# Altium schematic sheet 0217_GPU PCIE X16.SchDoc
size 848 x 558 mm
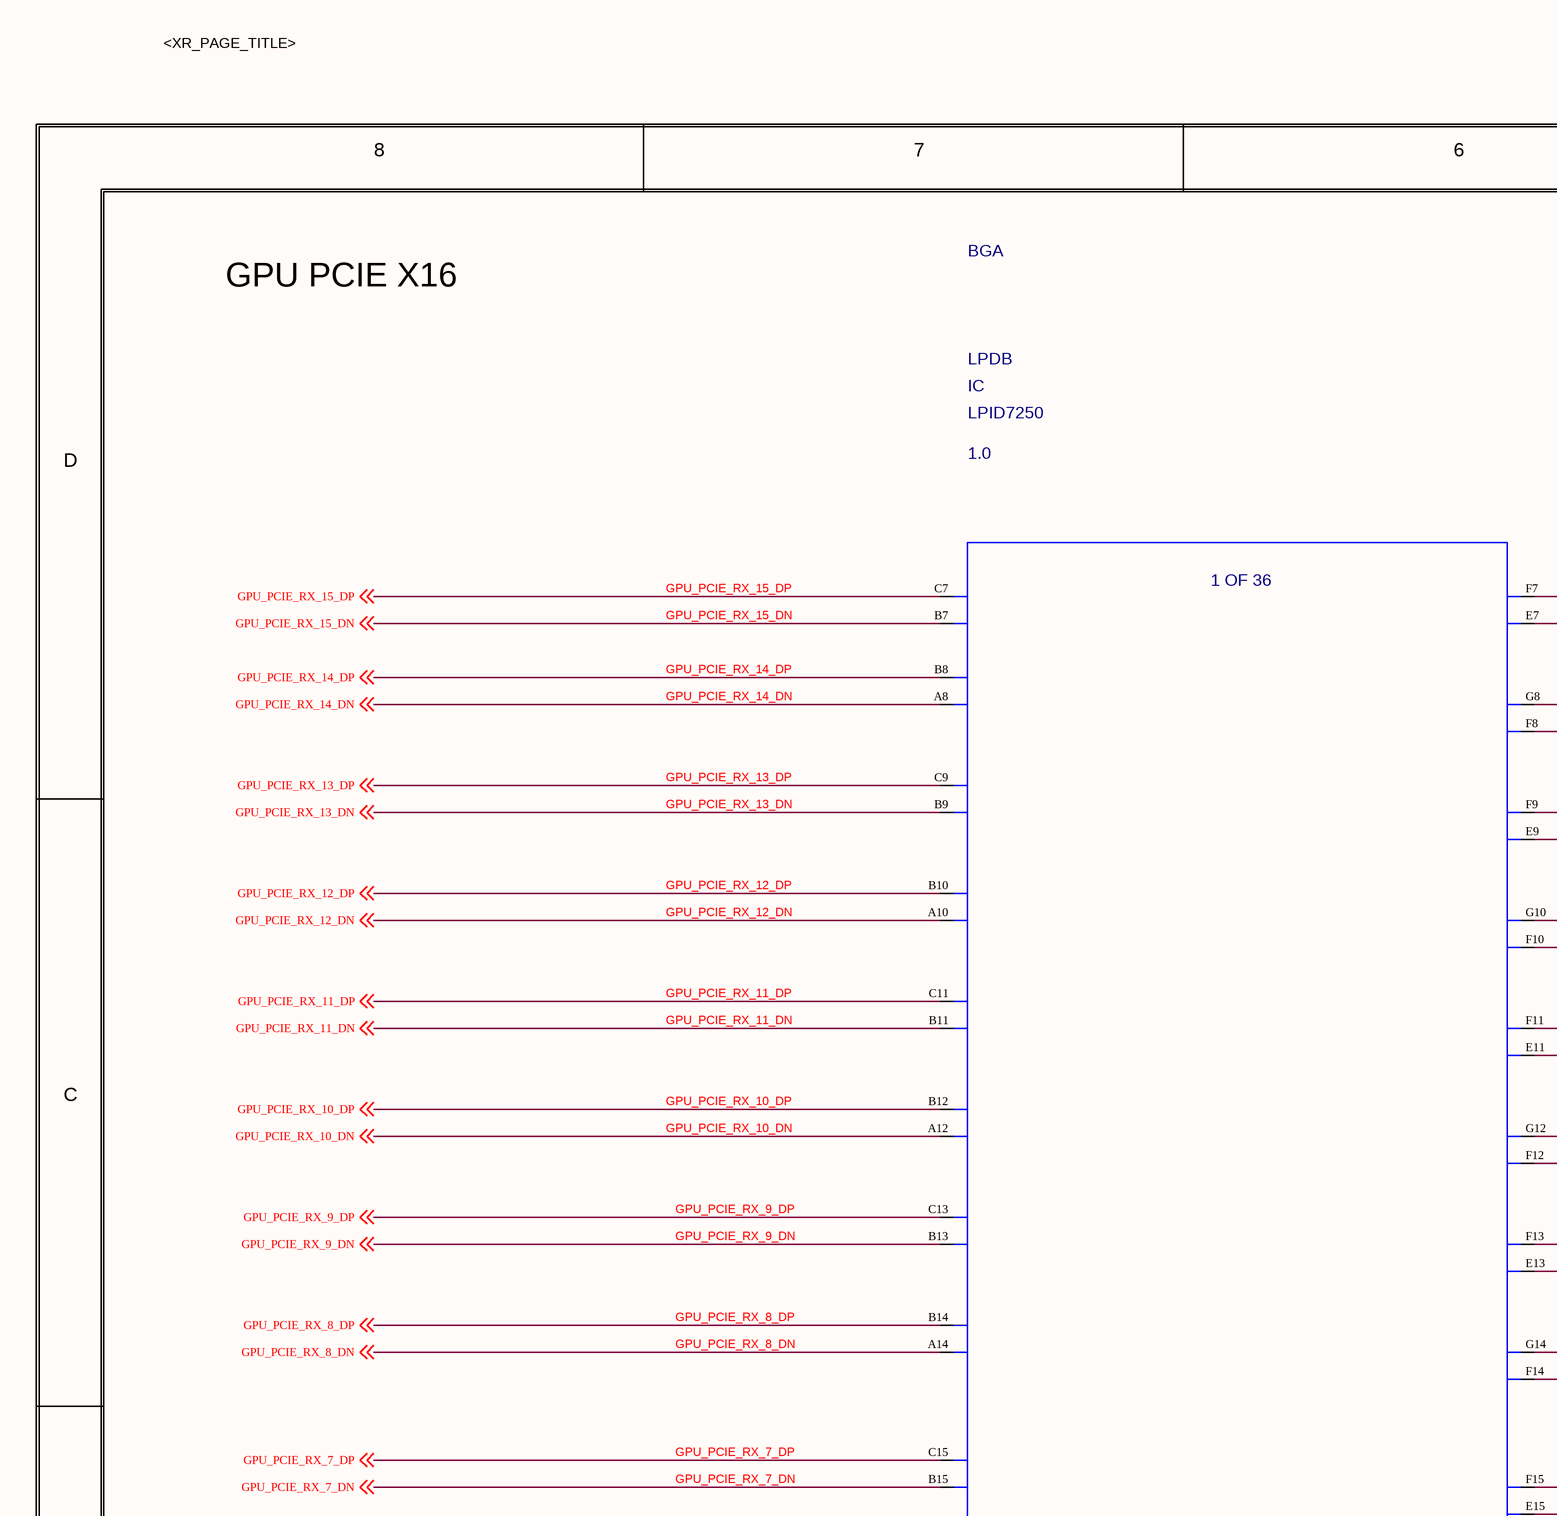
[diagram p0: 0217_GPU PCIE X16.SchDoc, top left]
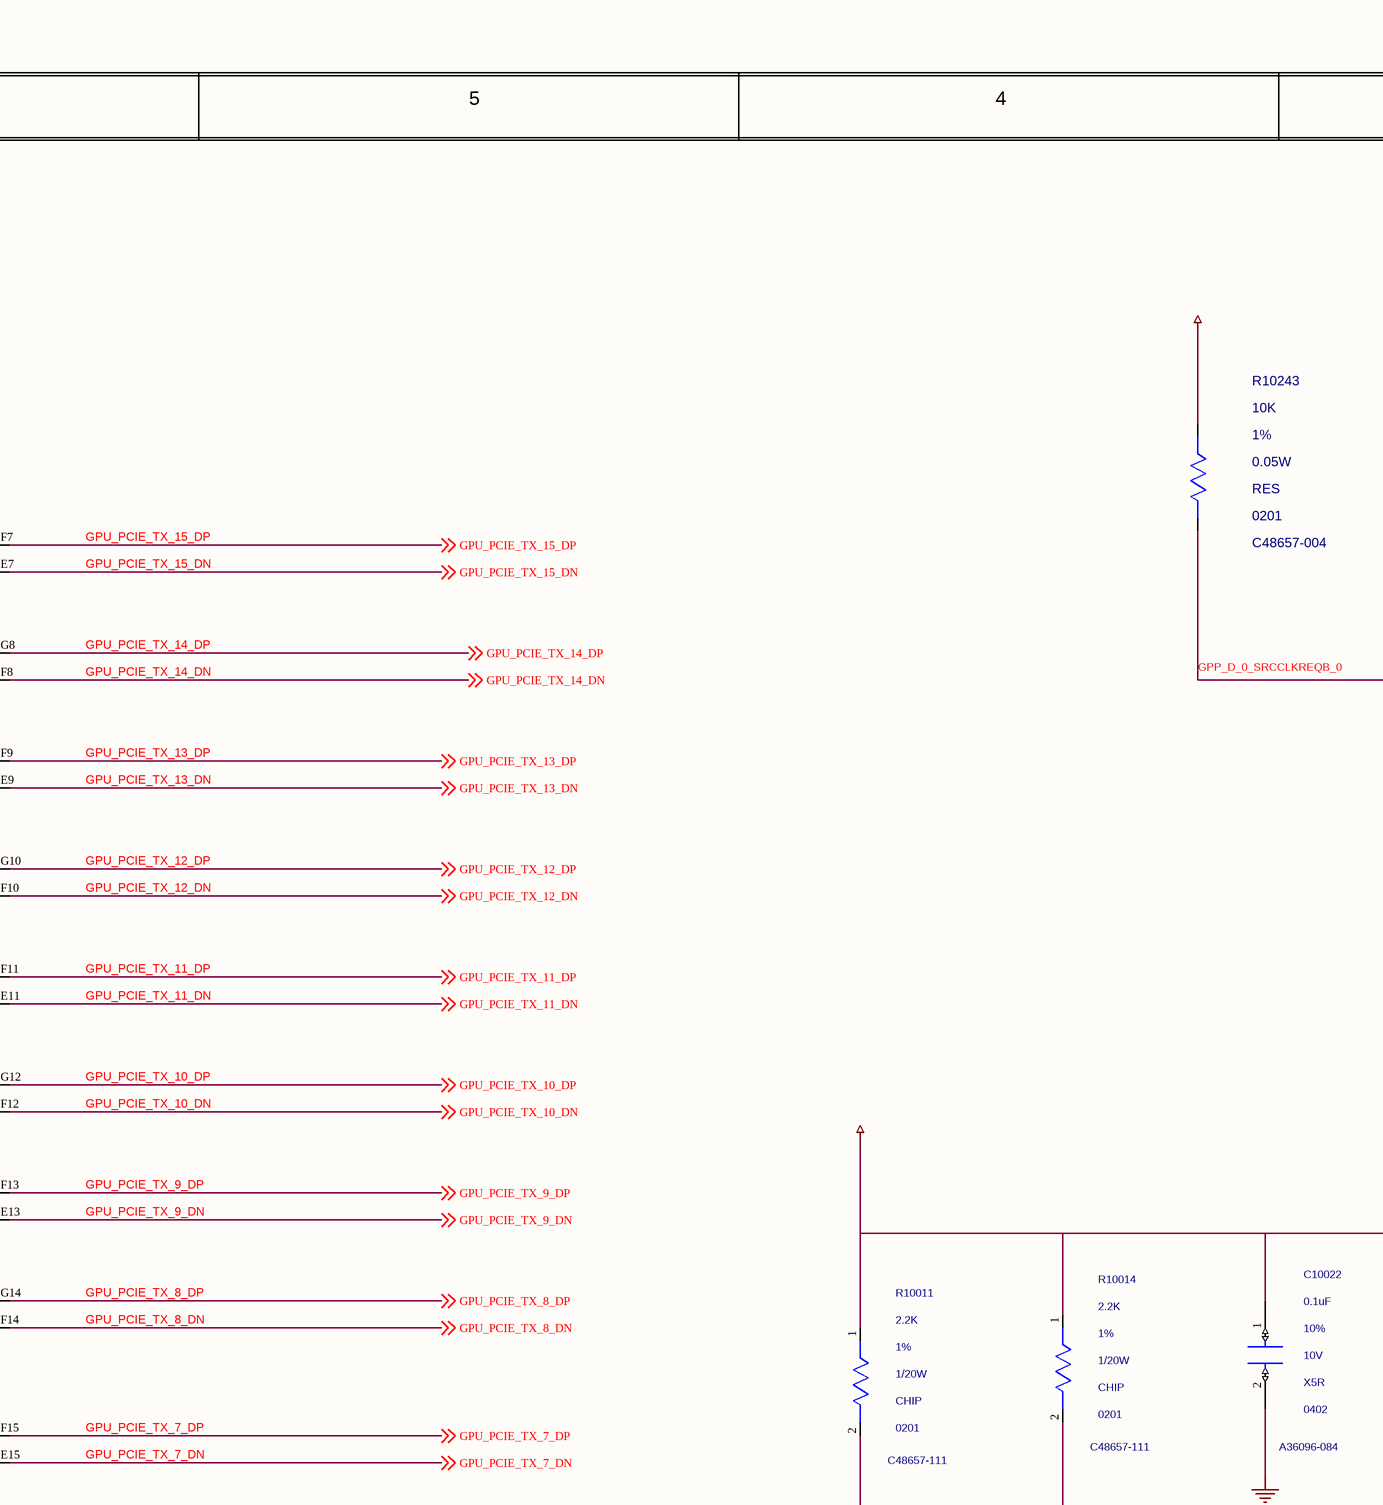
[diagram p1: 0217_GPU PCIE X16.SchDoc, top middle]
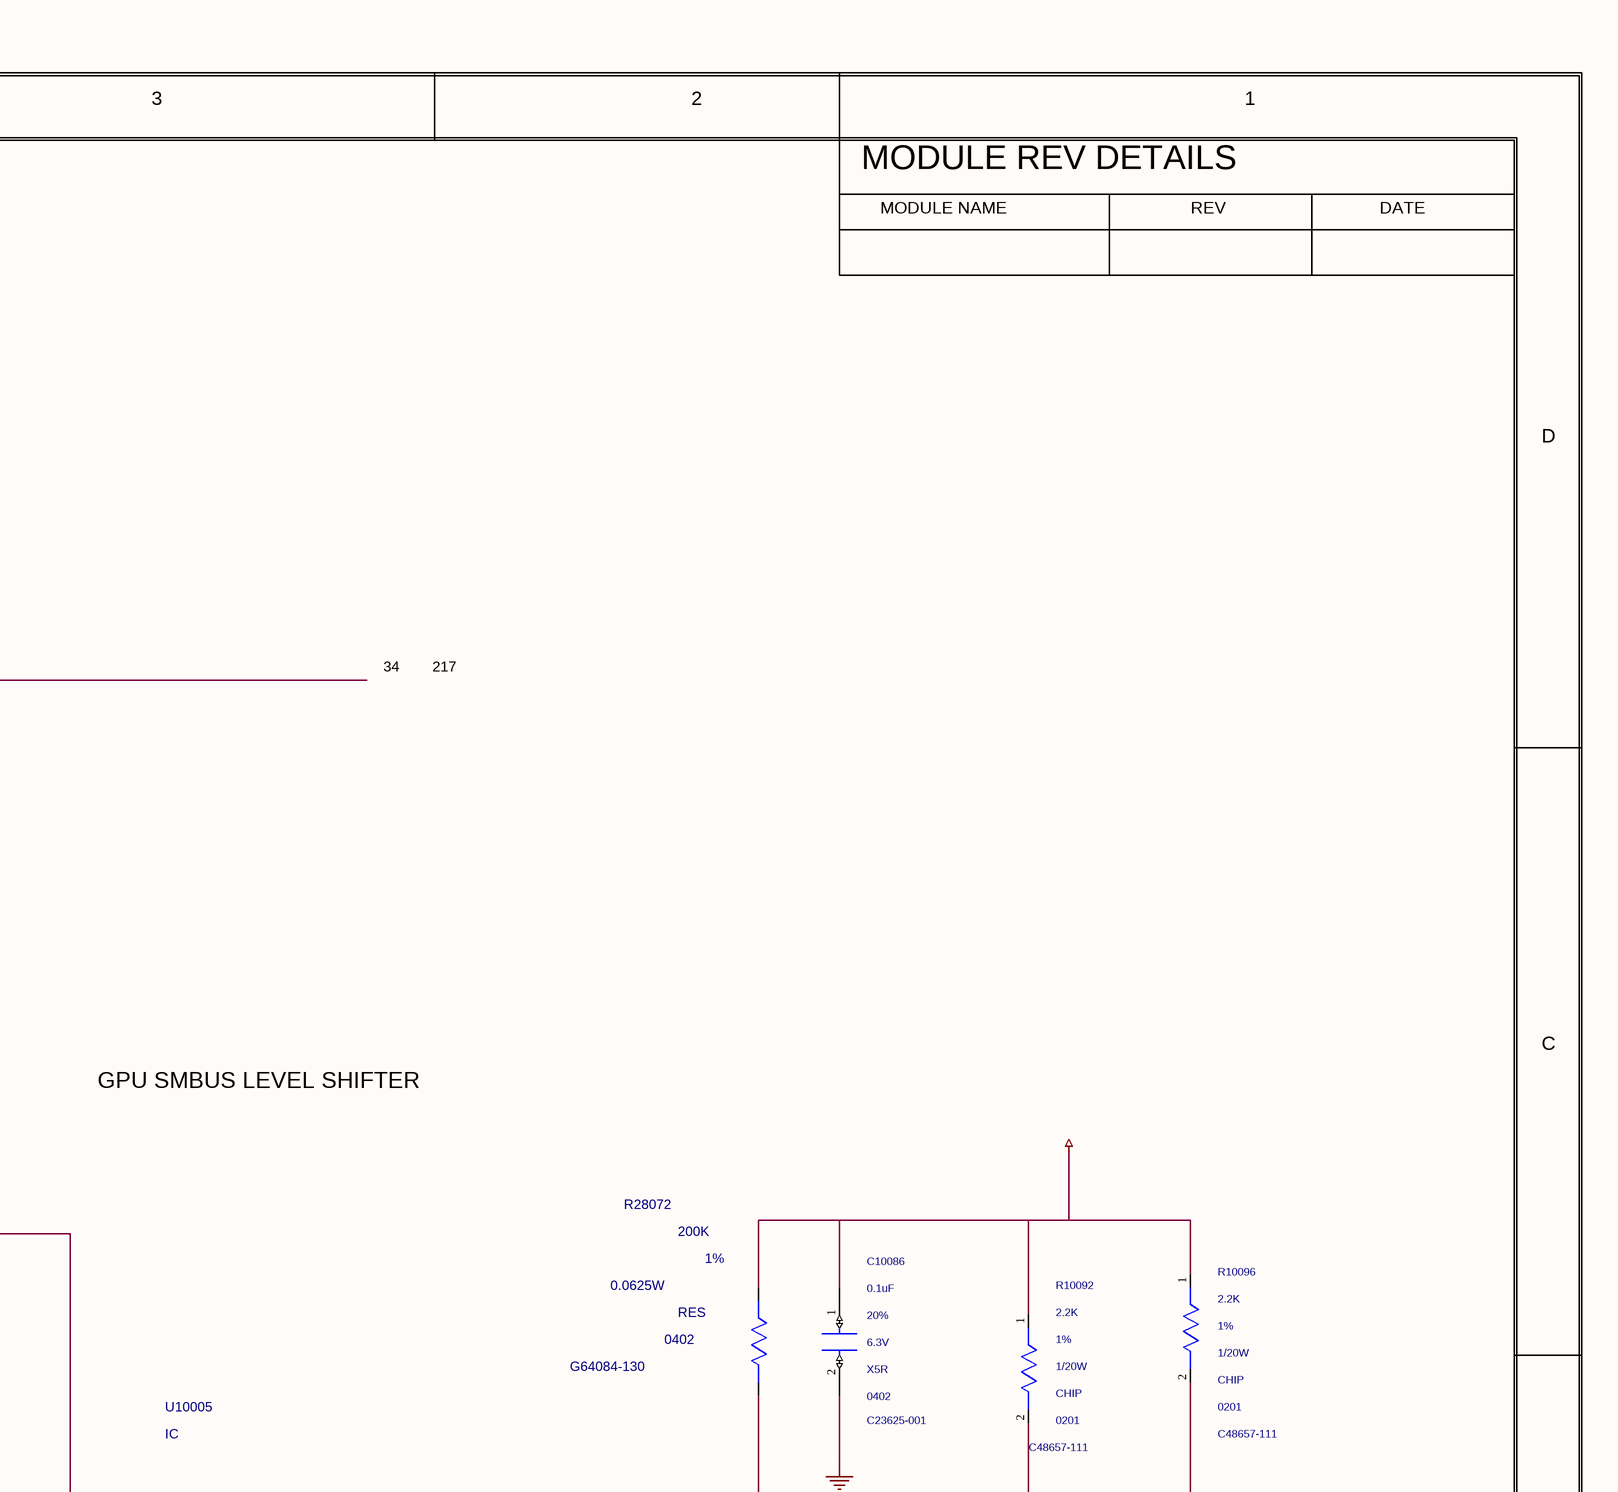
[diagram p2: 0217_GPU PCIE X16.SchDoc, top right]
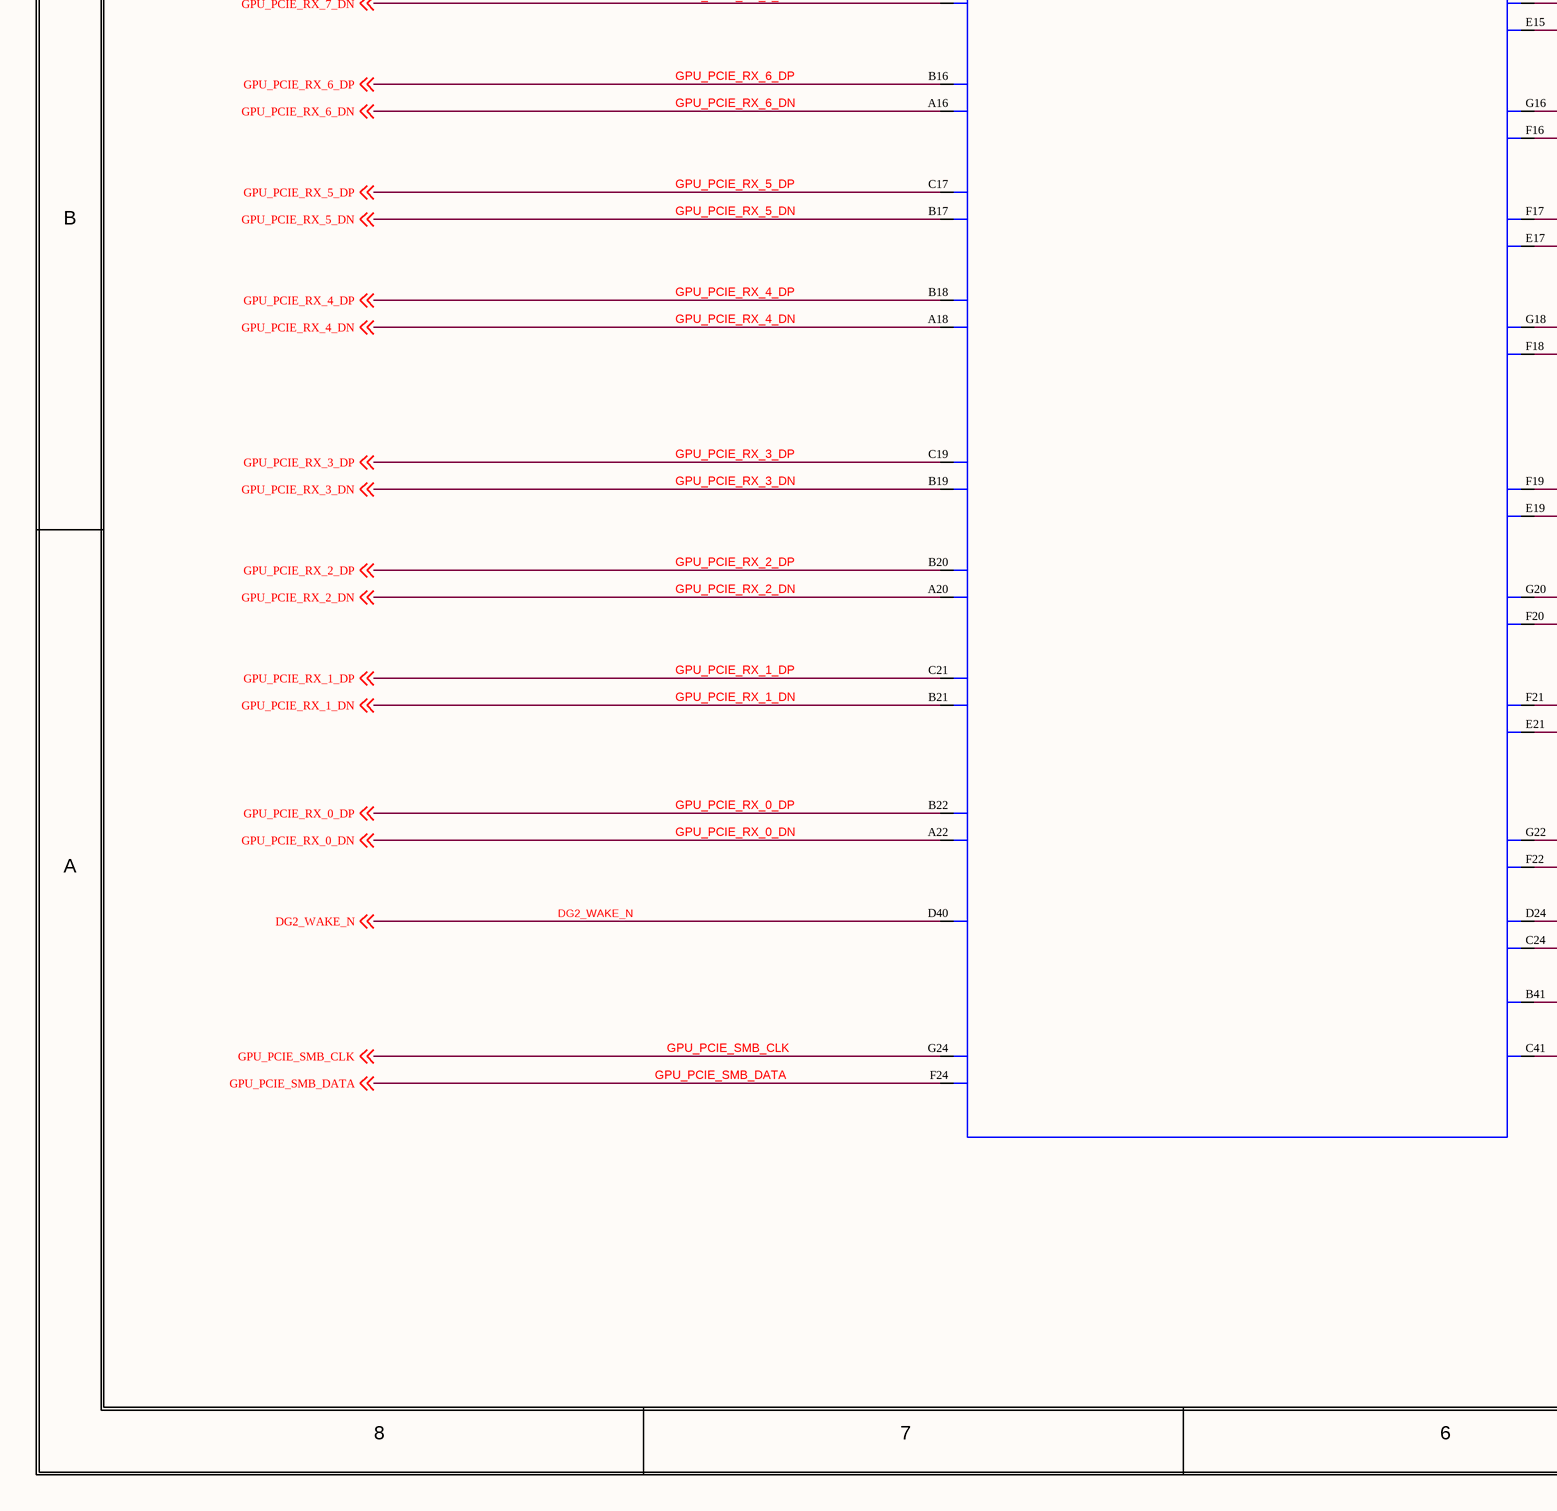
[diagram p3: 0217_GPU PCIE X16.SchDoc, bottom left]
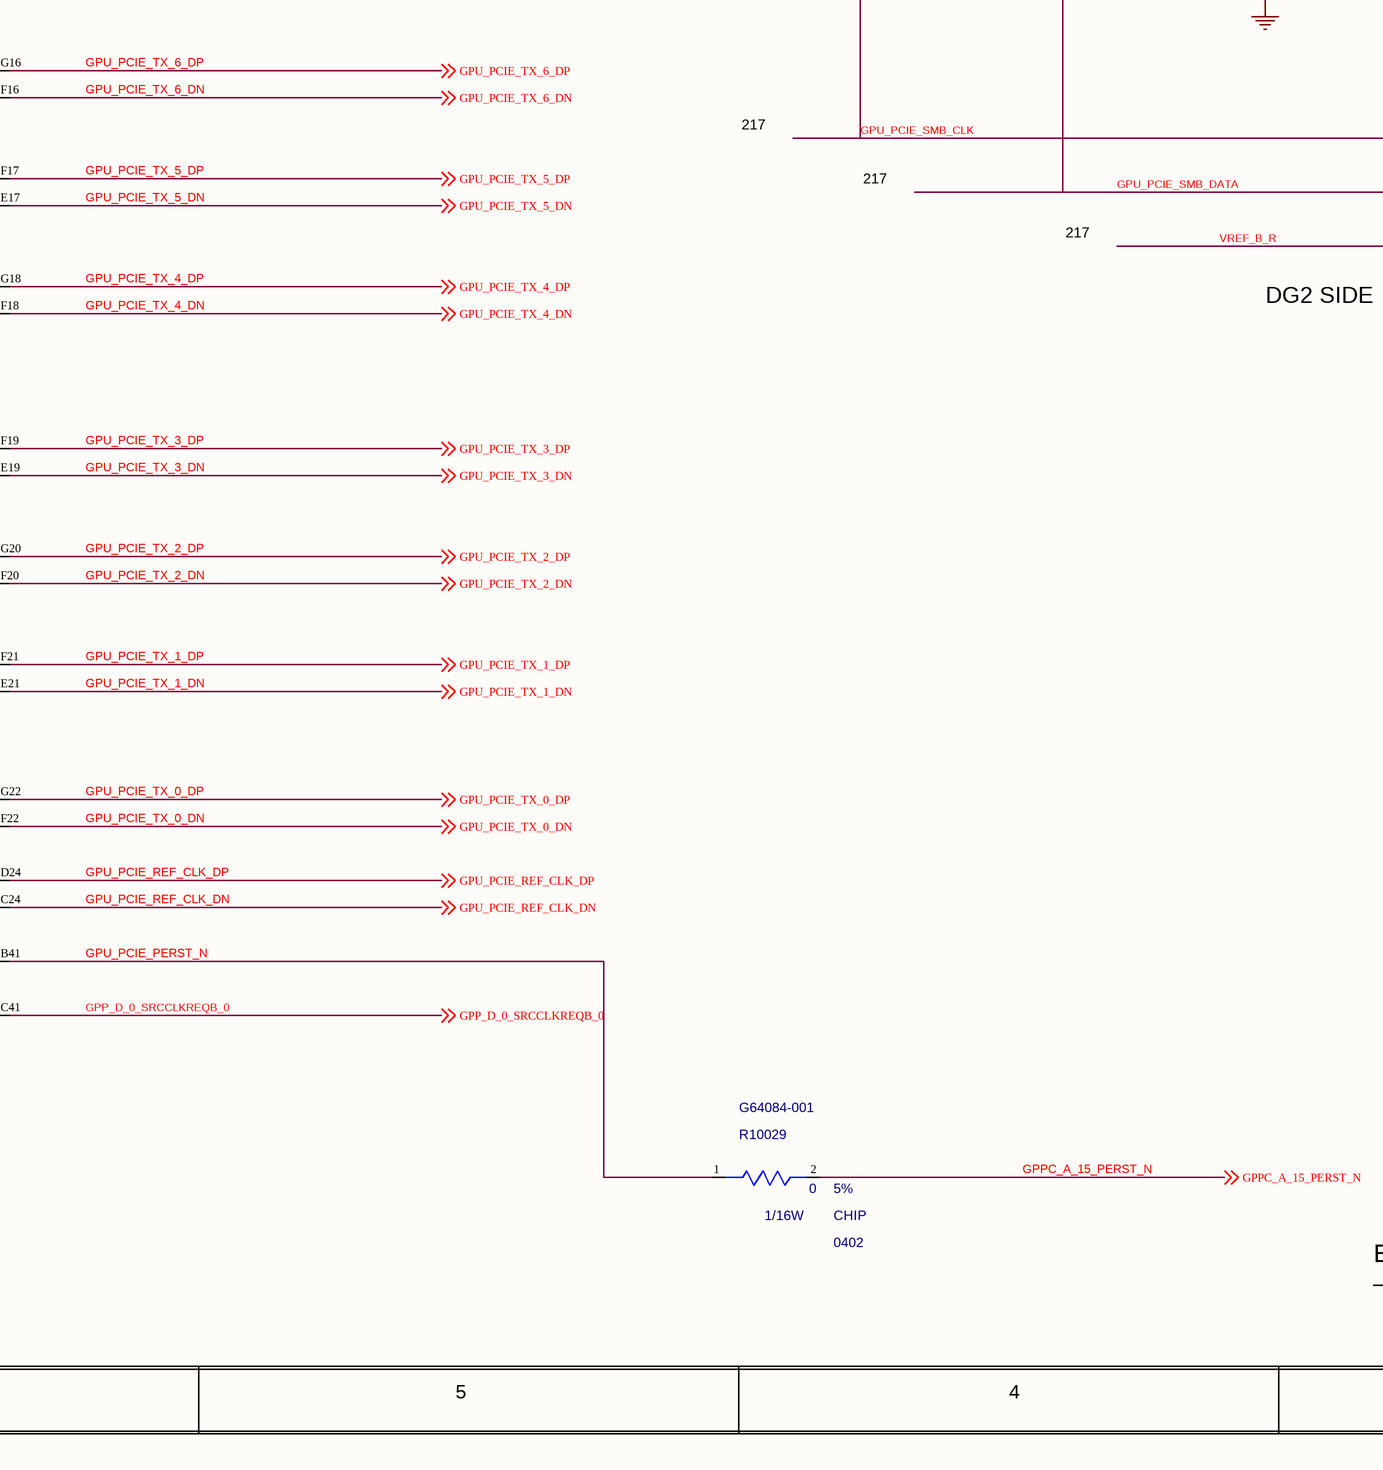
[diagram p4: 0217_GPU PCIE X16.SchDoc, bottom middle]
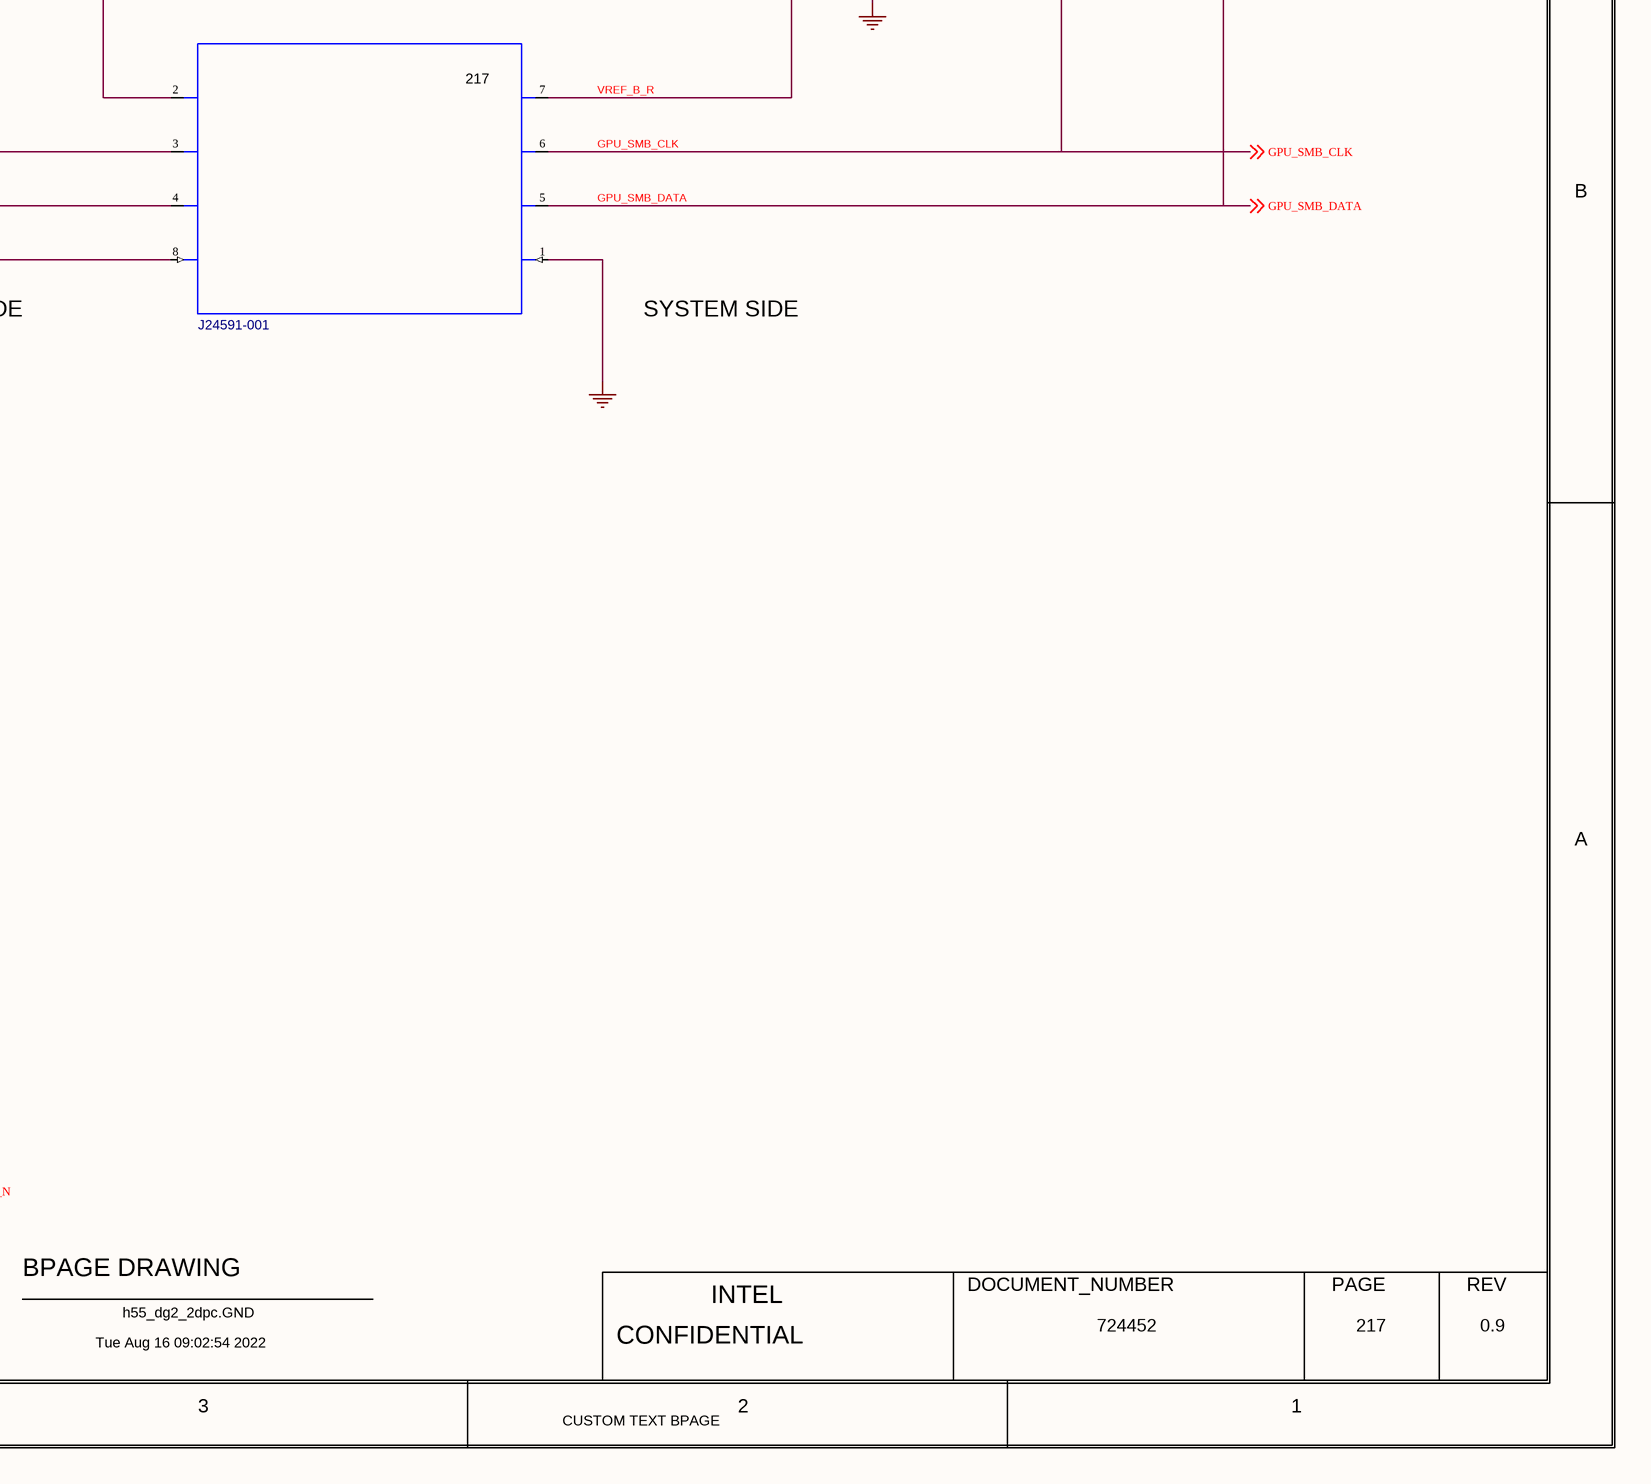
[diagram p5: 0217_GPU PCIE X16.SchDoc, bottom right]

## Parts
C10022  0.1uF  MATERIAL: X5R  PACK_TYPE: 0402  PART_NUMBER: A36096-084  TOLERANCE: 10%  VOLTAGE: 10V  [SMC0402IA]
C10086  0.1uF  MATERIAL: X5R  PACK_TYPE: 0402  PART_NUMBER: C23625-001  TOLERANCE: 20%  VOLTAGE: 6.3V  [SMC0402IA]
R10011  2.2K  MATERIAL: CHIP  PACK_TYPE: 0201  PART_NUMBER: C48657-111  TOLERANCE: 1%  WATTAGE: 1/20W  [SMR0201IA]
R10014  2.2K  MATERIAL: CHIP  PACK_TYPE: 0201  PART_NUMBER: C48657-111  TOLERANCE: 1%  WATTAGE: 1/20W  [SMR0201IA]
R10029  0  MATERIAL: CHIP  PACK_TYPE: 0402  PART_NUMBER: G64084-001  TOLERANCE: 5%  WATTAGE: 1/16W  [SMR0402IA]
R10092  2.2K  MATERIAL: CHIP  PACK_TYPE: 0201  PART_NUMBER: C48657-111  TOLERANCE: 1%  WATTAGE: 1/20W  [SMR0201IA]
R10096  2.2K  MATERIAL: CHIP  PACK_TYPE: 0201  PART_NUMBER: C48657-111  TOLERANCE: 1%  WATTAGE: 1/20W  [SMR0201IA]
R10243  10K  MATERIAL: RES  PACK_TYPE: 0201  PART_NUMBER: C48657-004  TOLERANCE: 1%  WATTAGE: 0.05W  [CTK0_SM0201_630X330_MA]
R28072  200K  MATERIAL: RES  PACK_TYPE: 0402  PART_NUMBER: G64084-130  TOLERANCE: 1%  WATTAGE: 0.0625W  [CTK0_SM0402_1100X550_MA]
U10000  PART_NUMBER: LPID7250  PACK_TYPE: BGA  MATERIAL: IC  FP_TECH: LPDB  BMAP_REV: 1.0  [CLPDB_BGA2660_DG2_SVC_512_LP7250_MA]  (hidden comment: DG2_IP_NB_SKU1_SKU2_SKU3_EXT)  (part A of 36)
U10005  MATERIAL: IC  PART_NUMBER: J24591-001  [CTK0_VSSOP8_2400X2100_500_MA]  (hidden comment: C_LSF0102)

## Nets
+V1P8S_GPU: C10022.1(A) R10011.1(A) R10014.1(A) R10243.1(A) U10005.2(VREF_A)
+V3P3S_GPU: C10086.1(A) R10092.1(A) R10096.1(A) R28072.1(A)
GND: C10022.2(B) C10086.2(B) U10005.1(GND)
DG2_WAKE_N: U10000.D40(WAKE#) ; off-sheet DG2_WAKE_N
GPP_D_0_SRCCLKREQB_0: R10243.2(B) U10000.C41(CLKREQ#) ; off-sheet GPP_D_0_SRCCLKREQB_0
GPPC_A_15_PERST_N: R10029.2(B) ; off-sheet GPPC_A_15_PERST_N
GPU_PCIE_PERST_N: R10029.1(A) U10000.B41(PERST#)
GPU_PCIE_REF_CLK_DN: U10000.C24(PCIE_REF_CLK_N) ; off-sheet GPU_PCIE_REF_CLK_DN
GPU_PCIE_REF_CLK_DP: U10000.D24(PCIE_REF_CLK_P) ; off-sheet GPU_PCIE_REF_CLK_DP
GPU_PCIE_RX_0_DN: U10000.A22(PCIE_RX_N_0) ; off-sheet GPU_PCIE_RX_0_DN
GPU_PCIE_RX_0_DP: U10000.B22(PCIE_RX_P_0) ; off-sheet GPU_PCIE_RX_0_DP
GPU_PCIE_RX_1_DN: U10000.B21(PCIE_RX_N_1) ; off-sheet GPU_PCIE_RX_1_DN
GPU_PCIE_RX_1_DP: U10000.C21(PCIE_RX_P_1) ; off-sheet GPU_PCIE_RX_1_DP
GPU_PCIE_RX_2_DN: U10000.A20(PCIE_RX_N_2) ; off-sheet GPU_PCIE_RX_2_DN
GPU_PCIE_RX_2_DP: U10000.B20(PCIE_RX_P_2) ; off-sheet GPU_PCIE_RX_2_DP
GPU_PCIE_RX_3_DN: U10000.B19(PCIE_RX_N_3) ; off-sheet GPU_PCIE_RX_3_DN
GPU_PCIE_RX_3_DP: U10000.C19(PCIE_RX_P_3) ; off-sheet GPU_PCIE_RX_3_DP
GPU_PCIE_RX_4_DN: U10000.A18(PCIE_RX_N_4) ; off-sheet GPU_PCIE_RX_4_DN
GPU_PCIE_RX_4_DP: U10000.B18(PCIE_RX_P_4) ; off-sheet GPU_PCIE_RX_4_DP
GPU_PCIE_RX_5_DN: U10000.B17(PCIE_RX_N_5) ; off-sheet GPU_PCIE_RX_5_DN
GPU_PCIE_RX_5_DP: U10000.C17(PCIE_RX_P_5) ; off-sheet GPU_PCIE_RX_5_DP
GPU_PCIE_RX_6_DN: U10000.A16(PCIE_RX_N_6) ; off-sheet GPU_PCIE_RX_6_DN
GPU_PCIE_RX_6_DP: U10000.B16(PCIE_RX_P_6) ; off-sheet GPU_PCIE_RX_6_DP
GPU_PCIE_RX_7_DN: U10000.B15(PCIE_RX_N_7) ; off-sheet GPU_PCIE_RX_7_DN
GPU_PCIE_RX_7_DP: U10000.C15(PCIE_RX_P_7) ; off-sheet GPU_PCIE_RX_7_DP
GPU_PCIE_RX_8_DN: U10000.A14(PCIE_RX_N_8) ; off-sheet GPU_PCIE_RX_8_DN
GPU_PCIE_RX_8_DP: U10000.B14(PCIE_RX_P_8) ; off-sheet GPU_PCIE_RX_8_DP
GPU_PCIE_RX_9_DN: U10000.B13(PCIE_RX_N_9) ; off-sheet GPU_PCIE_RX_9_DN
GPU_PCIE_RX_9_DP: U10000.C13(PCIE_RX_P_9) ; off-sheet GPU_PCIE_RX_9_DP
GPU_PCIE_RX_10_DN: U10000.A12(PCIE_RX_N_10) ; off-sheet GPU_PCIE_RX_10_DN
GPU_PCIE_RX_10_DP: U10000.B12(PCIE_RX_P_10) ; off-sheet GPU_PCIE_RX_10_DP
GPU_PCIE_RX_11_DN: U10000.B11(PCIE_RX_N_11) ; off-sheet GPU_PCIE_RX_11_DN
GPU_PCIE_RX_11_DP: U10000.C11(PCIE_RX_P_11) ; off-sheet GPU_PCIE_RX_11_DP
GPU_PCIE_RX_12_DN: U10000.A10(PCIE_RX_N_12) ; off-sheet GPU_PCIE_RX_12_DN
GPU_PCIE_RX_12_DP: U10000.B10(PCIE_RX_P_12) ; off-sheet GPU_PCIE_RX_12_DP
GPU_PCIE_RX_13_DN: U10000.B9(PCIE_RX_N_13) ; off-sheet GPU_PCIE_RX_13_DN
GPU_PCIE_RX_13_DP: U10000.C9(PCIE_RX_P_13) ; off-sheet GPU_PCIE_RX_13_DP
GPU_PCIE_RX_14_DN: U10000.A8(PCIE_RX_N_14) ; off-sheet GPU_PCIE_RX_14_DN
GPU_PCIE_RX_14_DP: U10000.B8(PCIE_RX_P_14) ; off-sheet GPU_PCIE_RX_14_DP
GPU_PCIE_RX_15_DN: U10000.B7(PCIE_RX_N_15) ; off-sheet GPU_PCIE_RX_15_DN
GPU_PCIE_RX_15_DP: U10000.C7(PCIE_RX_P_15) ; off-sheet GPU_PCIE_RX_15_DP
GPU_PCIE_SMB_CLK: R10011.2(B) U10000.G24(PCIE_SMB_CLK) U10005.3(A1) ; off-sheet GPU_PCIE_SMB_CLK
GPU_PCIE_SMB_DATA: R10014.2(B) U10000.F24(PCIE_SMB_DATA) U10005.4(A2) ; off-sheet GPU_PCIE_SMB_DATA
GPU_PCIE_TX_0_DN: U10000.F22(PCIE_TX_N_0) ; off-sheet GPU_PCIE_TX_0_DN
GPU_PCIE_TX_0_DP: U10000.G22(PCIE_TX_P_0) ; off-sheet GPU_PCIE_TX_0_DP
GPU_PCIE_TX_1_DN: U10000.E21(PCIE_TX_N_1) ; off-sheet GPU_PCIE_TX_1_DN
GPU_PCIE_TX_1_DP: U10000.F21(PCIE_TX_P_1) ; off-sheet GPU_PCIE_TX_1_DP
GPU_PCIE_TX_2_DN: U10000.F20(PCIE_TX_N_2) ; off-sheet GPU_PCIE_TX_2_DN
GPU_PCIE_TX_2_DP: U10000.G20(PCIE_TX_P_2) ; off-sheet GPU_PCIE_TX_2_DP
GPU_PCIE_TX_3_DN: U10000.E19(PCIE_TX_N_3) ; off-sheet GPU_PCIE_TX_3_DN
GPU_PCIE_TX_3_DP: U10000.F19(PCIE_TX_P_3) ; off-sheet GPU_PCIE_TX_3_DP
GPU_PCIE_TX_4_DN: U10000.F18(PCIE_TX_N_4) ; off-sheet GPU_PCIE_TX_4_DN
GPU_PCIE_TX_4_DP: U10000.G18(PCIE_TX_P_4) ; off-sheet GPU_PCIE_TX_4_DP
GPU_PCIE_TX_5_DN: U10000.E17(PCIE_TX_N_5) ; off-sheet GPU_PCIE_TX_5_DN
GPU_PCIE_TX_5_DP: U10000.F17(PCIE_TX_P_5) ; off-sheet GPU_PCIE_TX_5_DP
GPU_PCIE_TX_6_DN: U10000.F16(PCIE_TX_N_6) ; off-sheet GPU_PCIE_TX_6_DN
GPU_PCIE_TX_6_DP: U10000.G16(PCIE_TX_P_6) ; off-sheet GPU_PCIE_TX_6_DP
GPU_PCIE_TX_7_DN: U10000.E15(PCIE_TX_N_7) ; off-sheet GPU_PCIE_TX_7_DN
GPU_PCIE_TX_7_DP: U10000.F15(PCIE_TX_P_7) ; off-sheet GPU_PCIE_TX_7_DP
GPU_PCIE_TX_8_DN: U10000.F14(PCIE_TX_N_8) ; off-sheet GPU_PCIE_TX_8_DN
GPU_PCIE_TX_8_DP: U10000.G14(PCIE_TX_P_8) ; off-sheet GPU_PCIE_TX_8_DP
GPU_PCIE_TX_9_DN: U10000.E13(PCIE_TX_N_9) ; off-sheet GPU_PCIE_TX_9_DN
GPU_PCIE_TX_9_DP: U10000.F13(PCIE_TX_P_9) ; off-sheet GPU_PCIE_TX_9_DP
GPU_PCIE_TX_10_DN: U10000.F12(PCIE_TX_N_10) ; off-sheet GPU_PCIE_TX_10_DN
GPU_PCIE_TX_10_DP: U10000.G12(PCIE_TX_P_10) ; off-sheet GPU_PCIE_TX_10_DP
GPU_PCIE_TX_11_DN: U10000.E11(PCIE_TX_N_11) ; off-sheet GPU_PCIE_TX_11_DN
GPU_PCIE_TX_11_DP: U10000.F11(PCIE_TX_P_11) ; off-sheet GPU_PCIE_TX_11_DP
GPU_PCIE_TX_12_DN: U10000.F10(PCIE_TX_N_12) ; off-sheet GPU_PCIE_TX_12_DN
GPU_PCIE_TX_12_DP: U10000.G10(PCIE_TX_P_12) ; off-sheet GPU_PCIE_TX_12_DP
GPU_PCIE_TX_13_DN: U10000.E9(PCIE_TX_N_13) ; off-sheet GPU_PCIE_TX_13_DN
GPU_PCIE_TX_13_DP: U10000.F9(PCIE_TX_P_13) ; off-sheet GPU_PCIE_TX_13_DP
GPU_PCIE_TX_14_DN: U10000.F8(PCIE_TX_N_14) ; off-sheet GPU_PCIE_TX_14_DN
GPU_PCIE_TX_14_DP: U10000.G8(PCIE_TX_P_14) ; off-sheet GPU_PCIE_TX_14_DP
GPU_PCIE_TX_15_DN: U10000.E7(PCIE_TX_N_15) ; off-sheet GPU_PCIE_TX_15_DN
GPU_PCIE_TX_15_DP: U10000.F7(PCIE_TX_P_15) ; off-sheet GPU_PCIE_TX_15_DP
GPU_SMB_CLK: R10092.2(B) U10005.6(B1) ; off-sheet GPU_SMB_CLK
GPU_SMB_DATA: R10096.2(B) U10005.5(B2) ; off-sheet GPU_SMB_DATA
VREF_B_R: R28072.2(B) U10005.7(VREF_B) U10005.8(EN)

## Notes on the sheet
- <XR_PAGE_TITLE>
- 8
- 7
- 6
- 5
- 4
- 3
- 2
- 1
- MODULE REV DETAILS
- GPU PCIE X16
- MODULE NAME
- REV
- DATE
- D
- 34
- 217
- C
- GPU SMBUS LEVEL SHIFTER
- (near U10005) 217
- B
- DG2 SIDE
- SYSTEM SIDE
- A
- BPAGE DRAWING
- INTEL
- DOCUMENT_NUMBER
- PAGE
- Tue Aug 16 09:02:54 2022
- h55_dg2_2dpc.GND
- CONFIDENTIAL
- 724452
- 0.9
- CUSTOM TEXT BPAGE
- (in symbol DG2_IP_NB_SKU1_SKU2_SKU3_EXT, part A) 1 OF 36

## Library data of the parts
C10022 = CAP: CDS_PHYS_PART_NAME: CAP_0402-A36096-084,X5R,0.1UF,10V,10%,LPDB,GENERIC; OriginalSymbolOrigin: (-50,25); XY: (5525,6350); VER: 1; ROT: 0; PHYS_PAGE: 217; LOCATION: C10022; DRAWING: @RVP1_ADL_SB_ADP_S_DDR5_SODIMM_2DPC_LIB.H55_DG2_2DPC(SCH_1):PAGE388; CDS_LIB: discrete; PCB Footprint: SMC0402IA; CHIPS_PART_NAME: CAP; CDS_PART_NAME: CAP_0402-A36096-084,X5R,0.1UF,10V,10%,LPDB,GENERIC; CDS_LOCATION: C10022
C10086 = CAP: CDS_PHYS_PART_NAME: CAP_0402-C23625-001,X5R,0.1UF,6.3V,20%,LPDB,GENERIC; OriginalSymbolOrigin: (-50,25); XY: (7300,6375); VER: 1; ROT: 0; PHYS_PAGE: 217; LOCATION: C10086; DRAWING: @RVP1_ADL_SB_ADP_S_DDR5_SODIMM_2DPC_LIB.H55_DG2_2DPC(SCH_1):PAGE388; CDS_LIB: discrete; PCB Footprint: SMC0402IA; CHIPS_PART_NAME: CAP; CDS_PART_NAME: CAP_0402-C23625-001,X5R,0.1UF,6.3V,20%,LPDB,GENERIC; CDS_LOCATION: C10086
R10011 = RES: CDS_PHYS_PART_NAME: RES_0201-C48657-111,CHIP,2.2K,1%,1/20W,LPDB,GENERIC; OriginalSymbolOrigin: (-25,75); XY: (4775,6300); VER: 2; ROT: 0; PHYS_PAGE: 217; LOCATION: R10011; IP: GENERIC; FP_TECH: LPDB; DRAWING: @RVP1_ADL_SB_ADP_S_DDR5_SODIMM_2DPC_LIB.H55_DG2_2DPC(SCH_1):PAGE388; CDS_LIB: discrete; PCB Footprint: SMR0201IA; CHIPS_PART_NAME: RES; CDS_PART_NAME: RES_0201-C48657-111,CHIP,2.2K,1%,1/20W,LPDB,GENERIC; CDS_LOCATION: R10011
R10014 = RES: CDS_PHYS_PART_NAME: RES_0201-C48657-111,CHIP,2.2K,1%,1/20W,LPDB,GENERIC; OriginalSymbolOrigin: (-25,75); XY: (5150,6325); VER: 2; ROT: 0; PHYS_PAGE: 217; LOCATION: R10014; IP: GENERIC; FP_TECH: LPDB; DRAWING: @RVP1_ADL_SB_ADP_S_DDR5_SODIMM_2DPC_LIB.H55_DG2_2DPC(SCH_1):PAGE388; CDS_LIB: discrete; PCB Footprint: SMR0201IA; CHIPS_PART_NAME: RES; CDS_PART_NAME: RES_0201-C48657-111,CHIP,2.2K,1%,1/20W,LPDB,GENERIC; CDS_LOCATION: R10014
R10029 = RES#1: CHIPS_PART_NAME: RES; CDS_PHYS_PART_NAME: RES_0402-G64084-001,CHIP,0,5%,1/16W,LPDB,GENERIC; OriginalSymbolOrigin: (-75,25); XY: (4600,3950); VER: 1; PHYS_PAGE: 217; LOCATION: R10029; IP: GENERIC; FP_TECH: LPDB; DRAWING: @RVP1_ADL_SB_ADP_S_DDR5_SODIMM_2DPC_LIB.H55_DG2_2DPC(SCH_1):PAGE388; CDS_LIB: discrete; PCB Footprint: SMR0402IA; ROT: 0; CDS_PART_NAME: RES_0402-G64084-001,CHIP,0,5%,1/16W,LPDB,GENERIC; CDS_LOCATION: R10029
R10092 = RES: CDS_PHYS_PART_NAME: RES_0201-C48657-111,CHIP,2.2K,1%,1/20W,LPDB,GENERIC; OriginalSymbolOrigin: (-25,75); XY: (7650,6325); VER: 2; ROT: 0; PHYS_PAGE: 217; LOCATION: R10092; IP: GENERIC; FP_TECH: LPDB; DRAWING: @RVP1_ADL_SB_ADP_S_DDR5_SODIMM_2DPC_LIB.H55_DG2_2DPC(SCH_1):PAGE388; CDS_LIB: discrete; PCB Footprint: SMR0201IA; CHIPS_PART_NAME: RES; CDS_PART_NAME: RES_0201-C48657-111,CHIP,2.2K,1%,1/20W,LPDB,GENERIC; CDS_LOCATION: R10092
R10096 = RES: CDS_PHYS_PART_NAME: RES_0201-C48657-111,CHIP,2.2K,1%,1/20W,LPDB,GENERIC; OriginalSymbolOrigin: (-25,75); XY: (7950,6400); VER: 2; ROT: 0; PHYS_PAGE: 217; LOCATION: R10096; IP: GENERIC; FP_TECH: LPDB; DRAWING: @RVP1_ADL_SB_ADP_S_DDR5_SODIMM_2DPC_LIB.H55_DG2_2DPC(SCH_1):PAGE388; CDS_LIB: discrete; PCB Footprint: SMR0201IA; CHIPS_PART_NAME: RES; CDS_PART_NAME: RES_0201-C48657-111,CHIP,2.2K,1%,1/20W,LPDB,GENERIC; CDS_LOCATION: R10096
R10243 = C_RES: CDS_PHYS_PART_NAME: C_RES_0201-C48657-004,RES,10K,1%,0.05W,TK0,GENERIC; CDS_LMAN_SYM_OUTLINE: -50,50,50,-50; FP_TECH: TK0; IP: GENERIC; ROOM: NONE; OriginalSymbolOrigin: (-25,75); XY: (5400,7975); VER: 2; ROT: 0; PHYS_PAGE: 217; LOCATION: R10243; DRAWING: @RVP1_ADL_SB_ADP_S_DDR5_SODIMM_2DPC_LIB.H55_DG2_2DPC(SCH_1):PAGE388; CDS_LIB: c_discrete; VARIANT: ?; PCB Footprint: CTK0_SM0201_630X330_MA; CHIPS_PART_NAME: C_RES; CDS_PART_NAME: C_RES_0201-C48657-004,RES,10K,1%,0.05W,TK0,GENERIC; CDS_LOCATION: R10243
R28072 = C_RES: CDS_PHYS_PART_NAME: C_RES_0402-G64084-130,RES,200K,1%,0.0625W,TK0,GENERIC; CDS_LMAN_SYM_OUTLINE: -50,50,50,-50; FP_TECH: TK0; IP: GENERIC; ROOM: NONE; OriginalSymbolOrigin: (-25,75); XY: (7150,6375); VER: 2; ROT: 0; PHYS_PAGE: 217; LOCATION: R28072; DRAWING: @RVP1_ADL_SB_ADP_S_DDR5_SODIMM_2DPC_LIB.H55_DG2_2DPC(SCH_1):PAGE388; CDS_LIB: c_discrete; VARIANT: ?; PCB Footprint: CTK0_SM0402_1100X550_MA; CHIPS_PART_NAME: C_RES; CDS_PART_NAME: C_RES_0402-G64084-130,RES,200K,1%,0.0625W,TK0,GENERIC; CDS_LOCATION: R28072
U10000 = DG2_IP_NB_SKU1_SKU2_SKU3_EXT: MANUF: INTEL CORP; CDS_PHYS_PART_NAME: DG2_IP_NB_SKU1_SKU2_SKU3_EXT_BGA-LPID7250,IC,DG2_IP_NB_SKU1_SKUA; CDS_LMAN_SYM_OUTLINE: -300,850,300,-800; OriginalSymbolOrigin: (-325,850); CaptureCellPackProp: DG2_IP_NB_SKU1_SKU2_SKU3_EXTA; XY: (2650,6000); VER: 1; ROT: 0; PHYS_PAGE: 217; MFG_PN: NONE; LOCATION: U10000; DRAWING: @RVP1_ADL_SB_ADP_S_DDR5_SODIMM_2DPC_LIB.H55_DG2_2DPC(SCH_1):PAGE388; CDS_LIB: rvp1_adl_sb_adp_s_ddr5_sodimm_2dpc_lib; PCB Footprint: CLPDB_BGA2660_DG2_SVC_512_LP7250_MA; CHIPS_PART_NAME: DG2_IP_NB_SKU1_SKU2_SKU3_EXT; CDS_PART_NAME: DG2_IP_NB_SKU1_SKU2_SKU3_EXT_BGA-LPID7250,IC,DG2_IP_NB_SKU1_SKUA; CDS_LOCATION: U10000
U10005 = C_LSF0102: CDS_PHYS_PART_NAME: C_LSF0102_VSSOP-J24591-001,IC,LSF0102DCUR,TK0,GENERIC; CDS_LMAN_SYM_OUTLINE: -300,250,300,-250; FP_TECH: TK0; IP: GENERIC; PACK_TYPE: VSSOP; ROOM: NONE; OriginalSymbolOrigin: (-325,250); XY: (6350,5825); VER: 1; ROT: 0; PHYS_PAGE: 217; LOCATION: U10005; DRAWING: @RVP1_ADL_SB_ADP_S_DDR5_SODIMM_2DPC_LIB.H55_DG2_2DPC(SCH_1):PAGE388; CDS_LIB: local; VARIANT: ?; PCB Footprint: CTK0_VSSOP8_2400X2100_500_MA; SEC_TYPE: VSSOP; CHIPS_PART_NAME: C_LSF0102; CDS_PART_NAME: C_LSF0102_VSSOP-J24591-001,IC,LSF0102DCUR,TK0,GENERIC; CDS_LOCATION: U10005